# Altium schematic sheet SSR_Ctrol.SchDoc
size A4
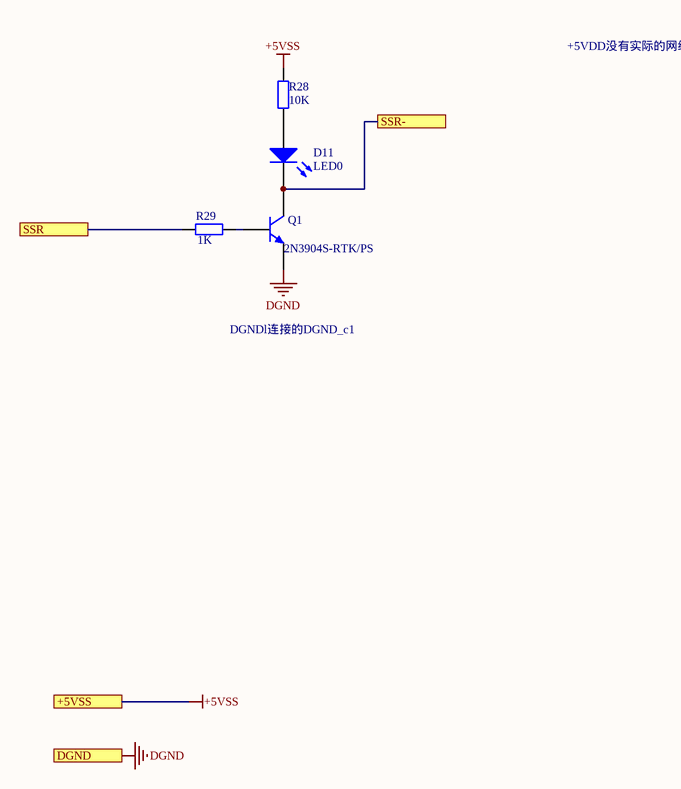
[diagram p0: SSR_Ctrol.SchDoc]

## Parts
D11  LED0  [0805LED]
Q1  2N3904S-RTK/PS  [SOT-23]
R28  10K  [0805R]
R29  1K  [0805R]

## Ports
+5VSS, DGND, SSR, SSR-

## Nets
+5VSS: R28.2 ; port +5VSS
DGND: Q1.2(E) ; port DGND
SSR: R29.1 ; port SSR
SSR-: D11.2(K) Q1.3(C) ; port SSR-
NetD11_1: D11.1(A) R28.1
NetQ1_1: Q1.1(B) R29.2

## Notes on the sheet
- +5VDD没有实际的网络标号
- DGNDl连接的DGND_c1

## Library data of the parts
D11 = LED0: 品牌： 国星光电 型号： NCD0805B2 发光颜色：蓝灯 贴片LED；0805蓝色；2012蓝色；透镜颜色：无色透明；发光角度：130°；功率：72mW；工作温度：-30℃~+85℃；; Published: 8-Jun-2000; LatestRevisionDate: 08-Jul-2005; LatestRevisionNote: Mech Layer 1 removed.; PackageReference: LED-0; Publisher: Altium Limited; PackageDescription: LED; 2 Leads
Q1 = 2N3904: 品牌： KEC  型号： 2N3904S-RTK/PS  晶体管类型：NPN 集射极击穿电压(Vceo)：40V 集电极电流(Ic)：200mA 功率(Pd)：350mW 直流电流增益(hFE@Ic,Vce)：100@10mA,1V NPN,Vceo=40V,Ic=200mA; Published: 8-Jun-2000; LatestRevisionDate: 15-Jan-2003; LatestRevisionNote: PCB Footprint 'BCY-W3/D4.7' replaced; DatasheetVersion: 1997; PackageVersion: Sep-1998; PackageReference: TO-92A; Publisher: Altium Limited; PackageDescription: TO, Flat Index; 3 In-Line, Axial Leads; Body Dia. 4.5mm; Leads 0.51 x 0.48 mm (max); ComponentLink1Description: Manufacturer Link; ComponentLink1URL: http://www.fairchildsemi.com/; ComponentLink2Description: Datasheet; ComponentLink2URL: http://www.fairchildsemi.com/ds/2N%2F2N3904.pdf
R28 = Res2: 品牌： UNI-ROYAL(厚声) 型号： 0805W8F1002T5E 电阻类型：厚膜电阻 阻值：10kΩ 精度：±1% 功率：125mW 温度系数：±100ppm/℃; Published: 8-Jun-2000; LatestRevisionDate: 17-Jul-2002; LatestRevisionNote: Re-released for DXP Platform.; PackageReference: AXIAL-0.4; Publisher: Altium Limited; PackageDescription: Axial Device, Thru-Hole; 2 Leads; 0.4 in Pin Spacing; Value: 10K
R29 = Res2: 品牌： UNI-ROYAL(厚声) 型号： 0805W8F1001T5E 电阻类型：厚膜电阻 阻值：1kΩ 精度：±1% 功率：125mW 温度系数：±100ppm/℃; Published: 8-Jun-2000; LatestRevisionDate: 17-Jul-2002; LatestRevisionNote: Re-released for DXP Platform.; PackageReference: AXIAL-0.4; Publisher: Altium Limited; PackageDescription: Axial Device, Thru-Hole; 2 Leads; 0.4 in Pin Spacing; Value: 1K